# Altium project PCB_Project1.PrjPCB
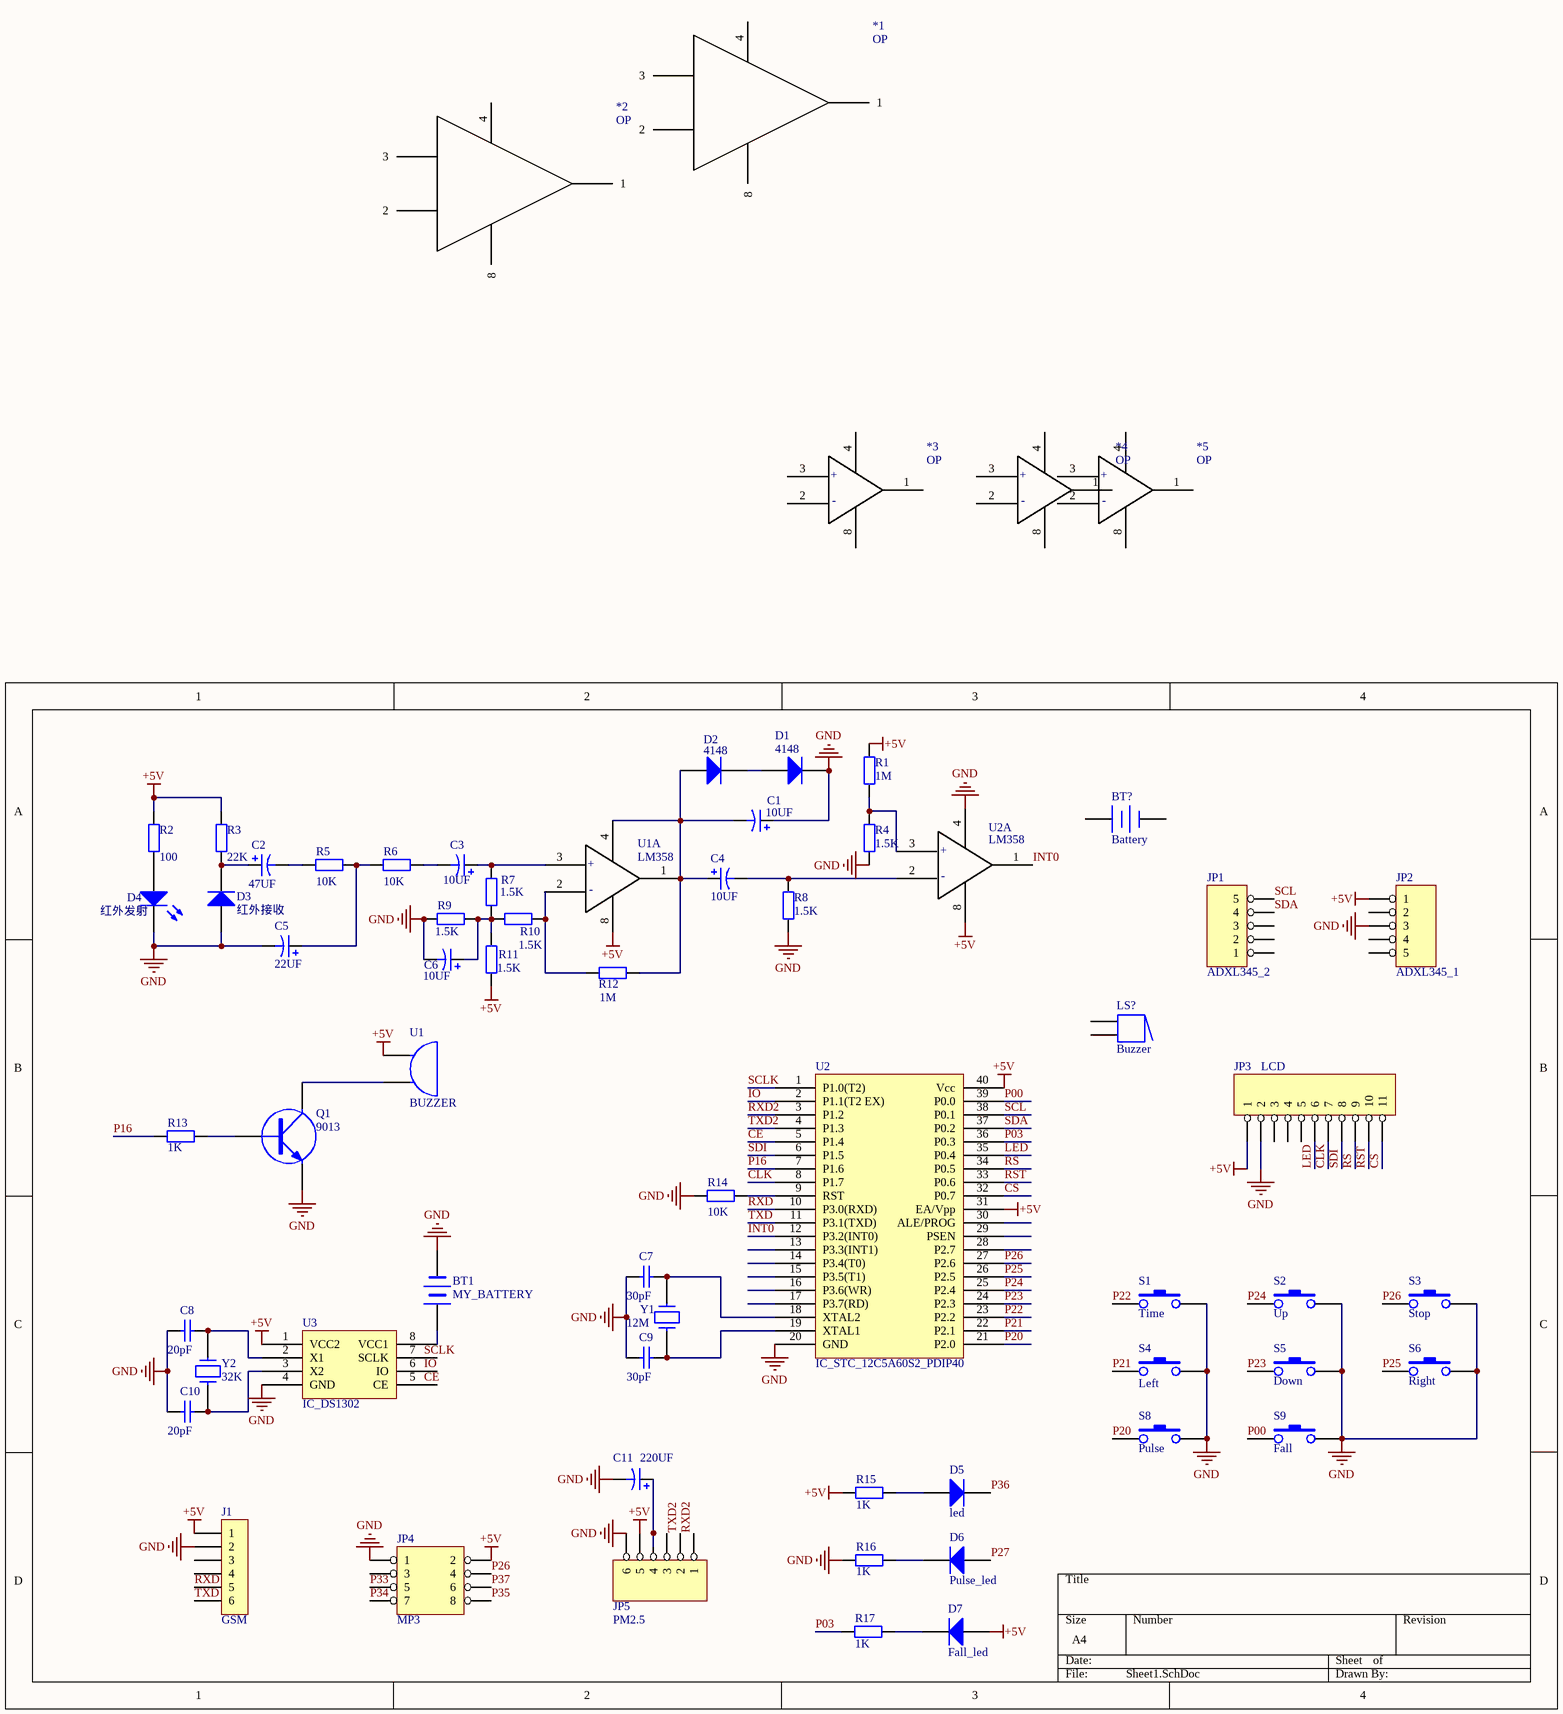
[diagram p0: Sheet1.SchDoc]
1 sheet, 65 parts. Net scope: global (net labels, ports and power ports of the same name join across sheets).

## Sheet Sheet1.SchDoc
size A4

### Parts
*1  OP
*2  OP
*3  OP
*4  OP
*5  OP
BT1  MY_BATTERY  [POWER_3V3_CR2032]
BT?  Battery  [BAT-2]
C1  value 10UF  [RB7.6-15]  (hidden comment: Cap Pol1)
C2  value 47UF  [RB7.6-15]  (hidden comment: Cap Pol1)
C3  value 10UF  [RB7.6-15]  (hidden comment: Cap Pol1)
C4  value 10UF  [RB7.6-15]  (hidden comment: Cap Pol1)
C5  value 22UF  [RB7.6-15]  (hidden comment: Cap Pol1)
C6  value 10UF  [RB7.6-15]  (hidden comment: Cap Pol1)
C7  value 30pF  [RAD-0.3]  (hidden comment: Cap)
C8  value 20pF  [RAD-0.3]  (hidden comment: Cap)
C9  value 30pF  [RAD-0.3]  (hidden comment: Cap)
C10  value 20pF  [RAD-0.3]  (hidden comment: Cap)
C11  value 220UF  [RB7.6-15]  (hidden comment: Cap Pol1)
D1  4148  [DO-41]
D2  4148  [DO-41]
D3  红外接收  [SMC]
D4  红外发射  [LED-1]
D5  led  [SMC]
D6  Pulse_led  [SMC]
D7  Fall_led  [SMC]
J1  GSM  [MY_SIP6]
JP1  ADXL345_2
JP2  ADXL345_1
JP3  LCD
JP4  MP3  [MY_IDC8]
JP5  PM2.5  [MY_SIP6]
LS?  Buzzer  [ABSM-1574]
Q1  9013
R1  value 1M  [AXIAL-0.4]  (hidden comment: Res2)
R2  value 100  [AXIAL-0.4]  (hidden comment: Res2)
R3  value 22K  [AXIAL-0.4]  (hidden comment: Res2)
R4  value 1.5K  [AXIAL-0.4]  (hidden comment: Res2)
R5  value 10K  [AXIAL-0.4]  (hidden comment: Res2)
R6  value 10K  [AXIAL-0.4]  (hidden comment: Res2)
R7  value 1.5K  [AXIAL-0.4]  (hidden comment: Res2)
R8  value 1.5K  [AXIAL-0.4]  (hidden comment: Res2)
R9  value 1.5K  [AXIAL-0.4]  (hidden comment: Res2)
R10  value 1.5K  [AXIAL-0.4]  (hidden comment: Res2)
R11  value 1.5K  [AXIAL-0.4]  (hidden comment: Res2)
R12  value 1M  [AXIAL-0.4]  (hidden comment: Res2)
R13  value 1K  [AXIAL-0.4]  (hidden comment: Res2)
R14  value 10K  [AXIAL-0.4]  (hidden comment: Res2)
R15  value 1K  [AXIAL-0.4]  (hidden comment: Res2)
R16  value 1K  [AXIAL-0.4]  (hidden comment: Res2)
R17  value 1K  [AXIAL-0.4]  (hidden comment: Res2)
S1  Time  [SW_KEY_1]
S2  Up  [SW_KEY_1]
S3  Stop  [SW_KEY_1]
S4  Left  [SW_KEY_1]
S5  Down  [SW_KEY_1]
S6  Right  [SW_KEY_1]
S8  Pulse  [SW_KEY_1]
S9  Fall  [SW_KEY_1]
U1  BUZZER
U1A  LM358
U2  IC_STC_12C5A60S2_PDIP40  [IC_STC_PDIP_40]
U2A  LM358
U3  IC_DS1302  [IC_SOP8_DS1302]
Y1  12M  [XTAL_HC49S]
Y2  32K  [XTAL_HC49S]

### Nets
+5V: D7.1(A) J1.1 JP2.1 JP3.1 JP4.2 JP5.5 R1.1 R2.2 R3.2 R11.1 R15.1 U1.1(A) U2.31(EA/Vpp) U2.40(Vcc) U3.1(VCC2)
GND: BT1.2(-) C1.1 C5.2 C6.2 C7.1 C8.1 C9.1 C10.1 C11.2 D1.2(K) D3.1(A) D4.2(K) J1.2 JP2.3 JP3.2 JP4.1 JP5.6 Q1.3(E) R4.2 R8.1 R9.1 R14.1 R16.1 S1.2 S2.2 S3.2 S4.2 S5.2 S6.2 S8.2 S9.2 U2.20(GND) U3.4(GND)
CE: U2.5(P1.4)
CLK: JP3.7 U2.8(P1.7)
CS: JP3.11 U2.32(P0.7)
INT0: U2.12(P3.2(INT0))
IO: U2.2(P1.1(T2_EX))
LED: JP3.6 U2.35(P0.4)
P00: S9.1 U2.39(P0.0)
P03: R17.1 U2.36(P0.3)
P16: R13.1 U2.7(P1.6)
P20: S8.1 U2.21(P2.0)
P21: S4.1 U2.22(P2.1)
P22: S1.1 U2.23(P2.2)
P23: S5.1 U2.24(P2.3)
P24: S2.1 U2.25(P2.4)
P25: S6.1 U2.26(P2.5)
P26: JP4.4 S3.1 U2.27(P2.6)
P27: D6.1(A)
P33: JP4.5
P34: JP4.7
P35: JP4.8
P36: D5.2(K)
P37: JP4.6
RS: JP3.9 U2.34(P0.5)
RST: JP3.10 U2.33(P0.6)
RXD: J1.5 U2.10(P3.0(RXD))
RXD2: JP5.1 U2.3(P1.2)
SCL: JP1.5 U2.38(P0.1)
SCLK: U2.1(P1.0(T2))
SDA: JP1.4 U2.37(P0.2)
SDI: JP3.8 U2.6(P1.5)
TXD: J1.6 U2.11(P3.1(TXD))
TXD2: JP5.2 U2.4(P1.3)
NetBT1_1: BT1.1(+) U3.8(VCC1)
NetC1_2: C1.2 C4.1 D2.1(A) R12.2
NetC2_1: C2.1 D3.2(K) R3.1
NetC2_2: C2.2 R5.1
NetC3_1: C3.1 R7.2
NetC3_2: C3.2 R6.1
NetC4_2: C4.2 R8.2
NetC5_1: C5.1 R5.2 R6.2
NetC6_1: C6.1 R7.1 R9.2 R10.1 R11.2
NetC7_2: C7.2 U2.18(XTAL2) Y1.2
NetC8_2: C8.2 U3.2(X1) Y2.2
NetC9_2: C9.2 U2.19(XTAL1) Y1.1
NetC10_2: C10.2 U3.3(X2) Y2.1
NetC11_1: C11.1 JP5.4
NetD1_1: D1.1(A) D2.2(K)
NetD4_1: D4.1(A) R2.1
NetD5_1: D5.1(A) R15.2
NetD6_2: D6.2(K) R16.2
NetD7_2: D7.2(K) R17.2
NetLS?_1: LS?.1 LS?.1A
NetLS?_2: LS?.2 LS?.2A
NetQ1_1: Q1.1(B) R13.2
NetQ1_2: Q1.2(C) U1.2(B)
NetR1_2: R1.2 R4.1
NetR10_2: R10.2 R12.1
NetR14_2: R14.2 U2.9(RST)

Not connected (* = marked no-connect by the designer): *1 1 2 3 4 8; *2 1 2 3 4 8; *3 1 2 3 4 8; *4 1 2 3 4 8; *5 1 2 3 4 8; BT? 1(+) 2(-); J1 3 4; JP1 1 2 3; JP2 2 4 5; JP3 3 4 5; JP4 3; JP5 3; U1A 1 2 3 4 8; U2 13(P3.3(INT1)) 14(P3.4(T0)) 15(P3.5(T1)) 16(P3.6(WR)) 17(P3.7(RD)) 28(P2.7) 29(PSEN) 30(ALE/PROG); U2A 1 2 3 4 8; U3 5(CE) 6(IO) 7(SCLK)

### Notes on the sheet
- Labels drawn without touching a wire or pin: +5V, CE, GND, INT0, IO, SCLK
- (in symbol OP) +; -

### Library data of the parts
BT1 = MY_BATTERY: Battery
BT? = Battery: Multicell Battery; Published: 24-Mar-1999; LatestRevisionDate: 17-Jul-2002; LatestRevisionNote: Re-released for DXP Platform.; PackageReference: BAT-2; Publisher: Altium Limited; PackageDescription: Battery; 2 Leads
C1-C6 C11 = Cap Pol1: Polarized Capacitor (Radial); Published: 8-Jun-2000; LatestRevisionDate: 17-Jul-2002; LatestRevisionNote: Re-released for DXP Platform.; PackageReference: RB7.6-15; Publisher: Altium Limited; PackageDescription: Polarized Capacitor (Radial); 2 Leads
C7-C10 = Cap: Capacitor; Published: 8-Jun-2000; LatestRevisionDate: 17-Jul-2002; LatestRevisionNote: Re-released for DXP Platform.; PackageReference: RAD-0.3; Publisher: Altium Limited; PackageDescription: Radial Cap, Thru-Hole; 2 Leads; 0.3 in Pin Spacing
D1 D2 = Diode 1N4007: 1 Amp General Purpose Rectifier; Published: 8-Jun-2000; LatestRevisionDate: 17-Jul-2002; LatestRevisionNote: Re-released for DXP Platform.; DatasheetVersion: 1998; PackageVersion: Aug-1999; PackageReference: DO-41; Publisher: Altium Limited; PackageDescription: Diode, Axial; Body 5.2 x 2.7 mm (LxDia. max), Lead Dia. 0.86 mm (max); Code_JEDEC: DO-204-AL; ComponentLink1Description: Manufacturer Link; ComponentLink1URL: http://www.fairchildsemi.com/; ComponentLink2Description: Datasheet; ComponentLink2URL: http://www.fairchildsemi.com/ds/1N%2F1N4001.pdf
D3 D5-D7 = Diode: Default Diode; Published: 8-Jun-2000; LatestRevisionDate: 17-Jul-2002; LatestRevisionNote: Re-released for DXP Platform.; PackageVersion: Sep-1996; PackageReference: SMC; Publisher: Altium Limited; PackageDescription: DO-214-AB/SMC; 2 C-Bend Leads; Body 7.9 x 5.9 mm, inc. leads (LxW); Code_JEDEC: DO-214-AB
D4 = LED1: Typical RED GaAs LED; Published: 8-Jun-2000; LatestRevisionDate: 08-Jul-2005; LatestRevisionNote: Mech Layer 1 removed.; PackageReference: LED-1; Publisher: Altium Limited; PackageDescription: LED; 2 Leads
J1 = MY_CON6: Connector
JP1 JP2 = HEADER 5
JP3 = HEADER 11
JP4 = MY_HEADER 4X2
JP5 = MY_HEADER 6
LS? = Buzzer: Magnetic Transducer Buzzer; Published: 24-Mar-1999; LatestRevisionDate: 17-Dec-2003; LatestRevisionNote: Schematic revised, PCB Footprint replaced.; DatasheetVersion: 17-Dec-2003; PackageReference: ABSM-1574; Publisher: Altium Limited; PackageDescription: Magnetic Transducer Buzzer; ComponentLink1Description: Manufacturer Link; ComponentLink1URL: http://www.megastar.com/linecard/buzzmode/index.php
Q1 = NPN: NPN Transistor
R1-R17 = Res2: Resistor; Published: 8-Jun-2000; LatestRevisionDate: 17-Jul-2002; LatestRevisionNote: Re-released for DXP Platform.; PackageReference: AXIAL-0.4; Publisher: Altium Limited; PackageDescription: Axial Device, Thru-Hole; 2 Leads; 0.4 in Pin Spacing
S1-S6 S8 S9 = MY_SW-PB
U1A U2A = OP
U2 = IC_STC_89C5**RC/RD+_PDIP40
Y1 Y2 = MY_CRYSTAL: Crystal